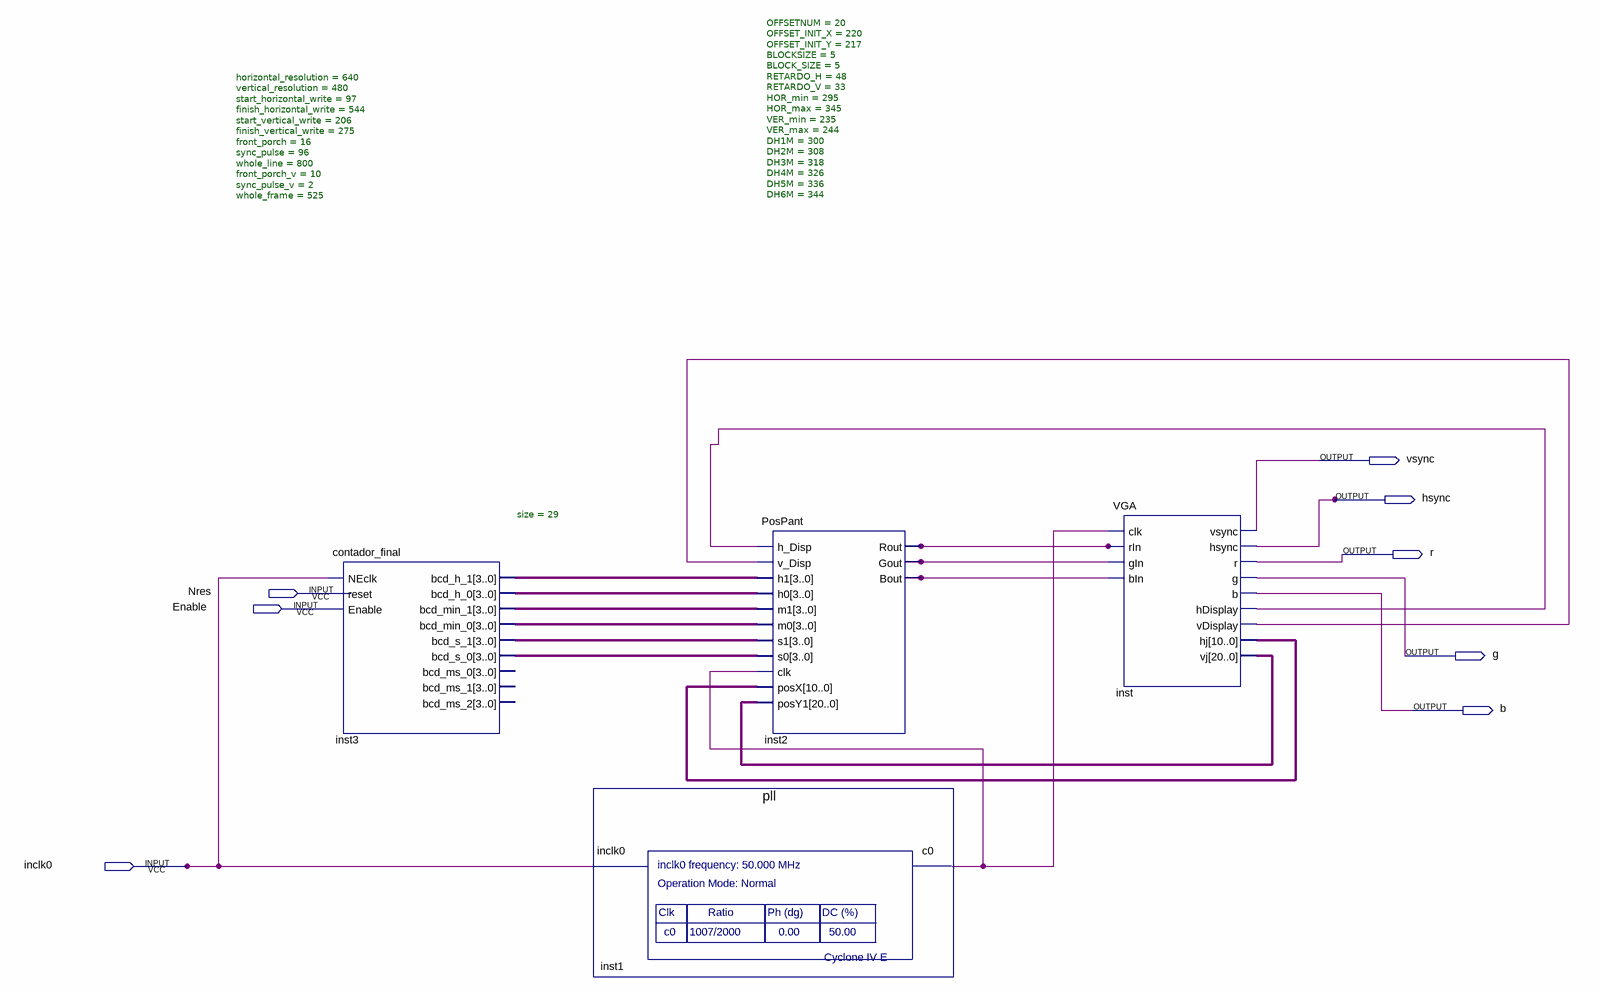
[diagram p0: schematic sheet]
// Quartus schematic main.bdf as structural Verilog: 4 symbols, 8 pins
module main (
  input  Nres,
  input  Enable,
  input  inclk0,
  output vsync,
  output hsync,
  output r,
  output g,
  output b
);

  wire inst1_c0, inst2_bout, inst2_gout, inst2_rout, inst_hdisplay, inst_vdisplay;
  wire [3:0] inst3_bcd_h_0, inst3_bcd_h_1, inst3_bcd_min_0, inst3_bcd_min_1, inst3_bcd_s_0, inst3_bcd_s_1;
  wire [10:0] inst_hj;
  wire [20:0] inst_vj;

  contador_final #(.size(29)) inst3 (
    .NEclk(inclk0), .bcd_h_1(inst3_bcd_h_1), .bcd_h_0(inst3_bcd_h_0), .bcd_min_1(inst3_bcd_min_1),
    .bcd_min_0(inst3_bcd_min_0), .bcd_s_1(inst3_bcd_s_1), .bcd_s_0(inst3_bcd_s_0));  // open: reset, Enable, bcd_ms_0, bcd_ms_1, bcd_ms_2
  pll inst1 (.inclk0(inclk0), .c0(inst1_c0));
  PosPant #(.OFFSETNUM(20), .OFFSET_INIT_X(220), .OFFSET_INIT_Y(217), .BLOCKSIZE(5), .BLOCK_SIZE(5), .RETARDO_H(48), .RETARDO_V(33), .HOR_min(295), .HOR_max(345), .VER_min(235), .VER_max(244), .DH1M(300), .DH2M(308), .DH3M(318), .DH4M(326), .DH5M(336), .DH6M(344)) inst2 (
    .h_Disp(inst_hdisplay), .v_Disp(inst_vdisplay), .h1(inst3_bcd_h_1), .h0(inst3_bcd_h_0),
    .m1(inst3_bcd_min_1), .m0(inst3_bcd_min_0), .s1(inst3_bcd_s_1), .s0(inst3_bcd_s_0), .clk(inst1_c0),
    .posX(inst_hj), .posY1(inst_vj), .Rout(inst2_rout), .Gout(inst2_gout), .Bout(inst2_bout));
  VGA #(.horizontal_resolution(640), .vertical_resolution(480), .start_horizontal_write(97), .finish_horizontal_write(544), .start_vertical_write(206), .finish_vertical_write(275), .front_porch(16), .sync_pulse(96), .whole_line(800), .front_porch_v(10), .sync_pulse_v(2), .whole_frame(525)) inst (
    .clk(inst1_c0), .rIn(inst2_rout), .gIn(inst2_gout), .bIn(inst2_bout), .vsync(vsync), .hsync(hsync),
    .r(r), .g(g), .b(b), .hDisplay(inst_hdisplay), .vDisplay(inst_vdisplay), .hj(inst_hj), .vj(inst_vj));
endmodule
